# EAGLE schematic ISensor V2.1 sch (EAGLE 7.2.0)
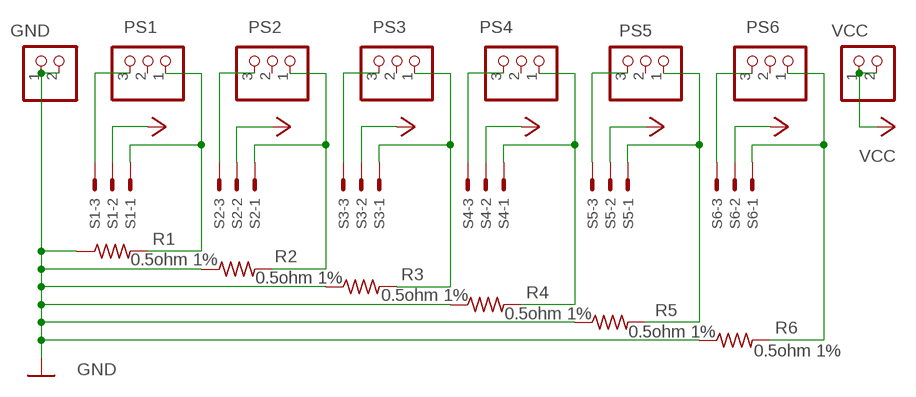
[diagram p0: schematic, sheet 1]

## Parts
GND  PINHD-1X2  [1X02]
PS1  PINHD-1X3  [1X03]
PS2  PINHD-1X3  [1X03]
PS3  PINHD-1X3  [1X03]
PS4  PINHD-1X3  [1X03]
PS5  PINHD-1X3  [1X03]
PS6  PINHD-1X3  [1X03]
R1  0.5ohm 1%  R-US_R2512  [R2512]
R2  0.5ohm 1%  R-US_R2512  [R2512]
R3  0.5ohm 1%  R-US_R2512  [R2512]
R4  0.5ohm 1%  R-US_R2512  [R2512]
R5  0.5ohm 1%  R-US_R2512  [R2512]
R6  0.5ohm 1%  R-US_R2512  [R2512]
S1  22-27-2031-03  [6410-03]
S2  22-27-2031-03  [6410-03]
S3  22-27-2031-03  [6410-03]
S4  22-27-2031-03  [6410-03]
S5  22-27-2031-03  [6410-03]
S6  22-27-2031-03  [6410-03]
VCC  PINHD-1X2  [1X02]

## Nets
N$1: PS1.3 S1.3
N$2: PS1.1 R1.2 S1.1
N$4: PS2.1 R2.2 S2.1
N$5: PS3.3 S3.3
N$6: PS3.1 R3.2 S3.1
N$7: PS4.3 S4.3
N$8: PS4.1 R4.2 S4.1
N$11: PS5.3 S5.3
N$12: PS5.1 R5.2 S5.1
N$13: PS6.3 S6.3
N$14: PS6.1 R6.2 S6.1
N$37: GND.1 GND.2 R1.1 R2.1 R3.1 R4.1 R5.1 R6.1 ; supply symbol labelled GND
PS2: PS2.3 S2.3
VCC: S1.2 S2.2 S3.2 S4.2 S5.2 S6.2 VCC.1 VCC.2
Unconnected: PS1.2 PS2.2 PS3.2 PS4.2 PS5.2 PS6.2

## Library data of the parts
GND VCC = pinhead:PINHD-1X2: PIN HEADER
PS1-PS6 = pinhead:PINHD-1X3: PIN HEADER
R1-R6 = resistor:R-US_: RESISTOR, American symbol
S1-S6 = con-molex:22-?-03: CONNECTOR wire to board 2.54 mm (.1 inch) pitch header; OC_FARNELL: unknown; OC_NEWARK: unknown